# EAGLE design HIJACK_LQPF_B (EAGLE 5.09)
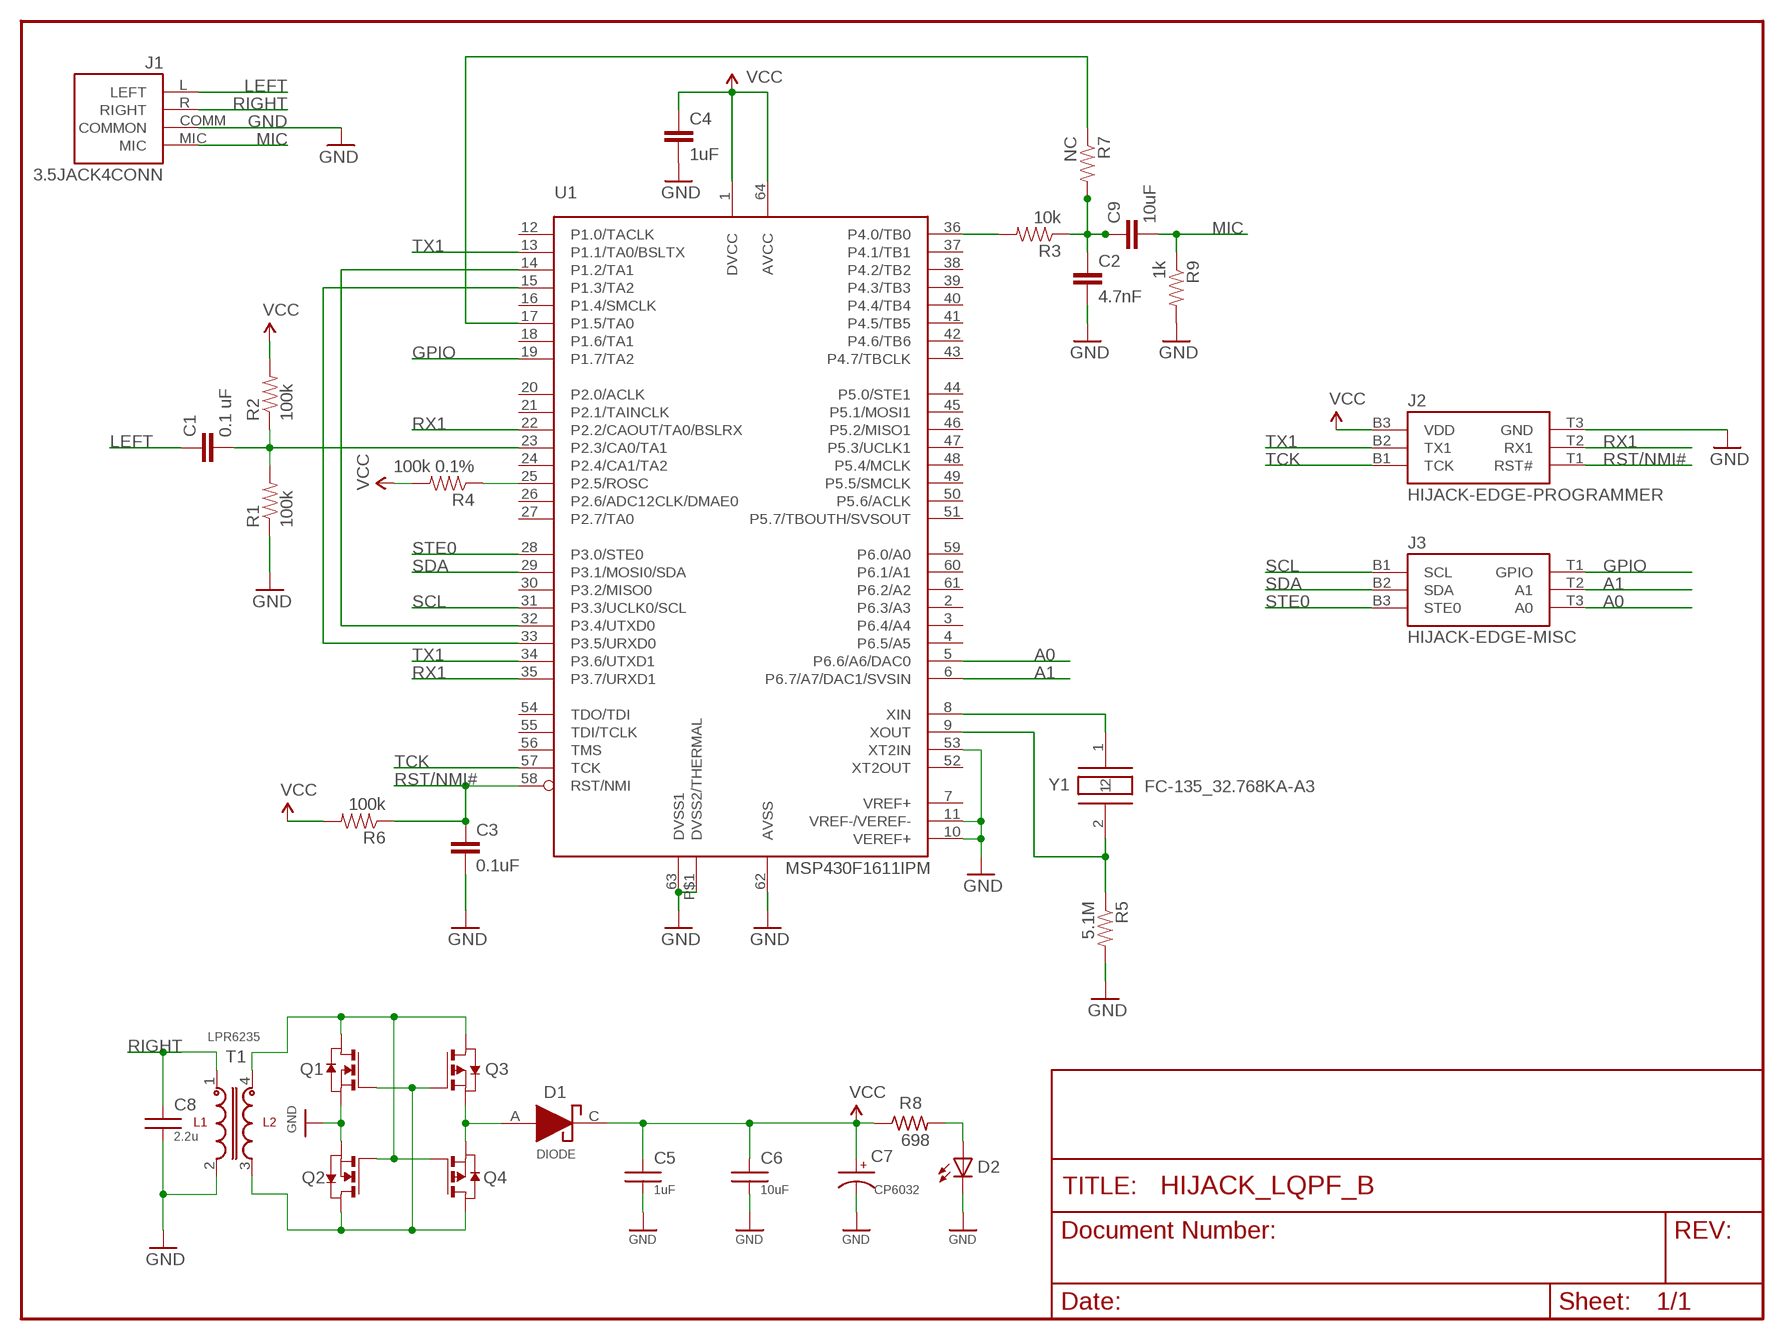
[diagram p0: schematic, sheet 1]

## Parts
C1  0.1 uF  CAP0603-CAP  [0603-CAP]
C2  4.7nF  CAP0603-CAP  [0603-CAP]
C3  0.1uF  CAP0603-CAP  [0603-CAP]
C4  1uF  CAP0603-CAP  [0603-CAP]
C5  1uF  C0603  [C0603]
C6  10uF  C0603  [C0603]
C7  CP6032  [CT6032]
C8  2.2u  C0603  [C0603]
C9  10uF  CAP0603-CAP  [0603-CAP]
D1  DIODE  [MINIMELF]
D2  LED0603  [LED-0603]
J1  3.5JACK4CONN  3.5JACK4CONNSUNSTONE_QUICKTURN  [PLUGBOARDCONNECTOR_SUNSTONE]
J2  HIJACK-EDGE-PROGRAMMER  [6-PIN-EDGE-CONNECTOR]
J3  HIJACK-EDGE-MISC  [6-PIN-EDGE-CONNECTOR]
Q1  NMOSSOT23  [SOT-23]
Q2  NMOSSOT23  [SOT-23]
Q3  PMOSSOT23  [SOT-23]
Q4  PMOSSOT23  [SOT-23]
R1  100k  RESISTOR0603-RES  [0603-RES]
R2  100k  RESISTOR0603-RES  [0603-RES]
R3  10k  RESISTOR0603-RES  [0603-RES]
R4  100k 0.1%  RESISTOR0603-RES  [0603-RES]
R5  5.1M  RESISTOR0603-RES  [0603-RES]
R6  100k  RESISTOR0603-RES  [0603-RES]
R7  NC  RESISTOR0603-RES  [0603-RES]
R8  698  R-US_R0603  [R0603]
R9  1k  RESISTOR0603-RES  [0603-RES]
T1  LPR6235  [LPR6235]
U1  MSP430F1611IPM  [PM/PAG64]
Y1  FC-135_32.768KA-A3  [FC-135]

## Nets
A0: J3.T3(A0) U1.5(P6.6/A6/DAC0)
A1: J3.T2(A1) U1.6(P6.7/A7/DAC1/SVSIN)
GND: C2.2 C3.2 C4.2 C5.2 C6.2 C7.- C8.2 D2.C J1.COMM(COMMON) J2.T3(GND) Q1.2(S) Q2.2(S) R1.1 R5.2 R9.2 T1.2 U1.10(VEREF+) U1.11(VREF-/VEREF-) U1.53(XT2IN) U1.62(AVSS) U1.63(DVSS1) U1.P$1(DVSS2/THERMAL)
GPIO: J3.T1(GPIO) U1.19(P1.7/TA2)
LEFT: C1.1 J1.L(LEFT)
MIC: C9.2 J1.MIC R9.1
N$1: C1.2 R1.2 R2.1 U1.23(P2.3/CA0/TA1)
N$2: U1.14(P1.2/TA1) U1.32(P3.4/UTXD0)
N$3: U1.15(P1.3/TA2) U1.33(P3.5/URXD0)
N$4: R4.1 U1.25(P2.5/ROSC)
N$5: U1.8(XIN) Y1.1
N$6: R7.1 U1.17(P1.5/TA0)
N$7: R3.2 U1.36(P4.0/TB0)
N$8: Q1.1(D) Q2.3(G) Q3.1(D) Q4.3(G) T1.4
N$9: Q1.3(G) Q2.1(D) Q3.3(G) Q4.1(D) T1.3
N$10: R5.1 U1.9(XOUT) Y1.2
N$11: D2.A R8.2
N$12: C2.1 C9.1 R3.1 R7.2
N$17: D1.A Q3.2(S) Q4.2(S)
RIGHT: C8.1 J1.R(RIGHT) T1.1
RST/NMI#: C3.1 J2.T1(RST#) R6.1 U1.58(RST/NMI)
RX1: J2.T2(RX1) U1.22(P2.2/CAOUT/TA0/BSLRX) U1.35(P3.7/URXD1)
SCL: J3.B1(SCL) U1.31(P3.3/UCLK0/SCL)
SDA: J3.B2(SDA) U1.29(P3.1/MOSI0/SDA)
STE0: J3.B3(STE0) U1.28(P3.0/STE0)
TCK: J2.B1(TCK) U1.57(TCK)
TX1: J2.B2(TX1) U1.13(P1.1/TA0/BSLTX) U1.34(P3.6/UTXD1)
VCC: C4.1 C5.1 C6.1 C7.+ D1.C J2.B3(VDD) R2.2 R4.2 R6.2 R8.1 U1.1(DVCC) U1.64(AVCC)
Unconnected: U1.2(P6.3/A3) U1.3(P6.4/A4) U1.4(P6.5/A5) U1.7(VREF+) U1.12(P1.0/TACLK) U1.16(P1.4/SMCLK) U1.18(P1.6/TA1) U1.20(P2.0/ACLK) U1.21(P2.1/TAINCLK) U1.24(P2.4/CA1/TA2) U1.26(P2.6/ADC12CLK/DMAE0) U1.27(P2.7/TA0) U1.30(P3.2/MISO0) U1.37(P4.1/TB1) U1.38(P4.2/TB2) U1.39(P4.3/TB3) U1.40(P4.4/TB4) U1.41(P4.5/TB5) U1.42(P4.6/TB6) U1.43(P4.7/TBCLK) U1.44(P5.0/STE1) U1.45(P5.1/MOSI1) U1.46(P5.2/MISO1) U1.47(P5.3/UCLK1) U1.48(P5.4/MCLK) U1.49(P5.5/SMCLK) U1.50(P5.6/ACLK) U1.51(P5.7/TBOUTH/SVSOUT) U1.52(XT2OUT) U1.54(TDO/TDI) U1.55(TDI/TCLK) U1.56(TMS) U1.59(P6.0/A0) U1.60(P6.1/A1) U1.61(P6.2/A2)

## Library data of the parts
C1-C4 C9 = SparkFun:CAP: Capacitor Standard 0603 ceramic capacitor, and 0.1" leaded capacitor.
C5 C6 C8 = umich:C
C7 = umich:CP
D1 = umich:DIODE
D2 = umich:LED: LEDs Standard schematic elements and footprints for 5mm, 3mm, 1206, and 0603 sized LEDs. 5mm - Spark Fun Electronics SKU : COM-00529 (and others)
J1 = Thomas:3.5JACK4CONN
J2 = Thomas:HIJACK-EDGE-PROGRAMMER
J3 = Thomas:HIJACK-EDGE-MISC
Q1 Q2 = zetex:NMOSSOT23: MOS FET
Q3 Q4 = zetex:PMOSSOT23: MOS FET
R1-R7 R9 = SparkFun:RESISTOR: Resistor Basic schematic elements and footprints for 0603, 1206, and PTH 1/10th watt (small) resistors.
R8 = rcl:R-US_: RESISTOR, American symbol
T1 = umich:LPR6235
U1 = Thomas:MSP430F1611
Y1 = berkeley-epic:FC-135_32.768KA-A3

## Board
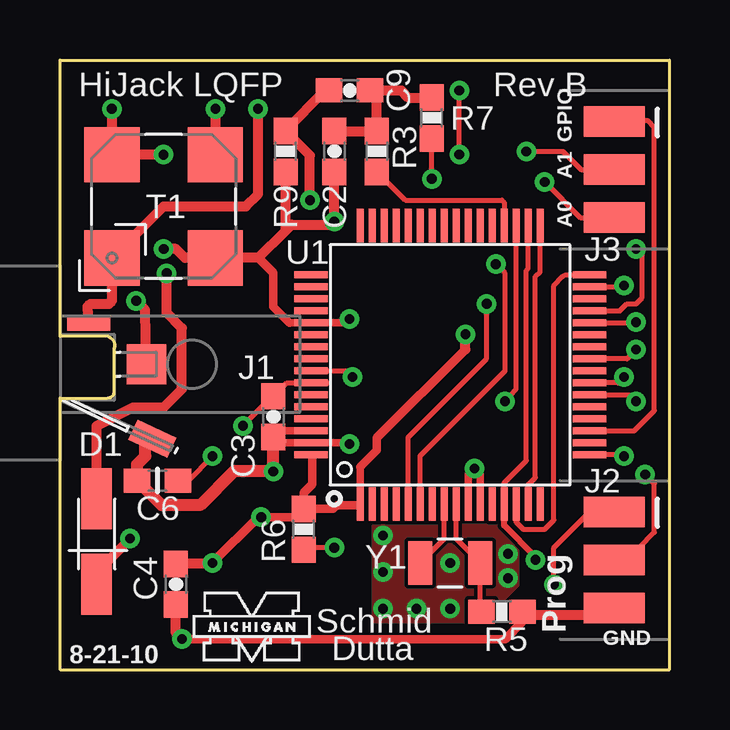
[diagram p1: board, top side]
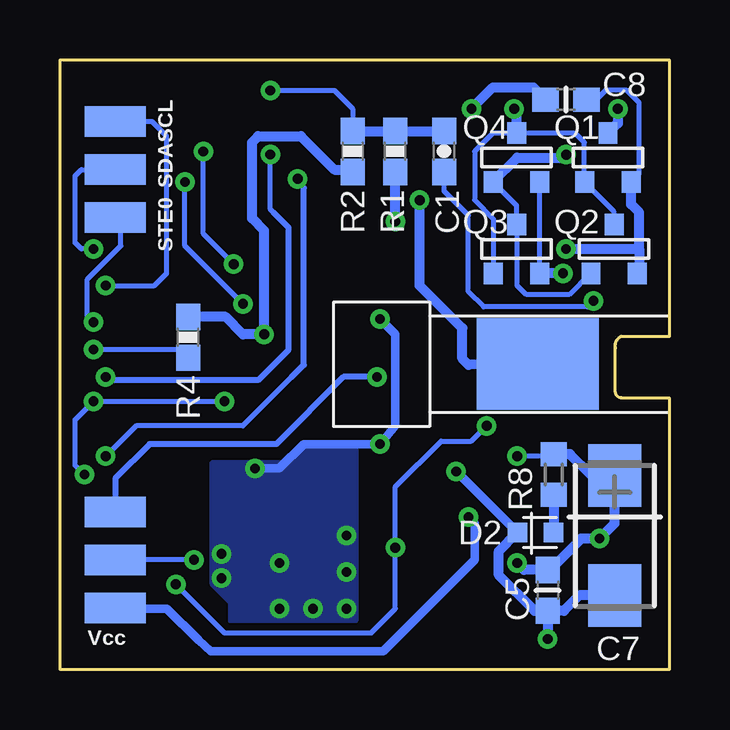
[diagram p2: board, bottom side, seen from below]

Size 25.4 x 25.4 mm. Coordinates in mm from the lower left corner, seen from the top.
Outline: 0,10.74 0,0 25.4,0 25.4,25.4 0,25.4 0,14.73
Copper layers (1*16): Top 0.0178mm / dielectric 1.4986mm / Bottom 0.0178mm
Design rules "SSC-EAGLE-2Lyr_v1.0.0.3 *": minimum track width 6mil, minimum drill 14mil, track to track 6mil, track to pad 6mil, pad to pad 6mil, via to via 6mil, smd to smd 6mil, copper to edge 20mil, drill to drill 16mil, minimum pad ring 8mil, minimum via ring 8mil, stop-mask expansion 3mil, vias tented up to drill 16mil, thermal gap 10mil

### Footprints (pad centres in the part's own frame; a part is rotated, then mirrored left to right if it is on the bottom)
0603-CAP = smd 1.1 x 1: 1 -0.85,0; 2 0.85,0
C0603 = smd 1.1 x 1: 1 -0.85,0; 2 0.85,0
CT6032 = smd 2.6 x 2.2: + -2.5,0; - 2.5,0
MINIMELF = smd 2.54 x 1.27: A -1.778,0; C 1.778,0
LED-0603 = smd 0.8 x 0.8: A 0,-0.75; C 0,0.75
PLUGBOARDCONNECTOR_SUNSTONE = smd 1.778 x 0.914 rotated 155: COMM 3.799,-3.103 | smd 1.651 x 1.651: L 3.55,0 | smd 5.08 x 3.81 bottom: MIC 5.45,0 | smd 1.778 x 0.635: R 1.15,1.706
6-PIN-EDGE-CONNECTOR = smd 2.54 x 1.27 bottom: B1 1.5,2; B2 1.5,0; B3 1.5,-2 | smd 2.54 x 1.27: T1 1.5,2; T2 1.5,0; T3 1.5,-2
SOT-23 = smd 0.787 x 0.889: 1 0.025,-1.016; 2 -0.94,1.016; 3 0.991,1.016
0603-RES = smd 1.1 x 1: 1 -0.85,0; 2 0.85,0
R0603 = smd 1 x 1.1: 1 -0.85,0; 2 0.85,0
LPR6235 = smd 2.3 x 2.3: 1 -2.15,2.15; 2 -2.15,-2.15; 3 2.15,-2.15; 4 2.15,2.15
PM/PAG64 = smd 1.4 x 0.3: 1 -5.8,3.75; 2 -5.8,3.25; 3 -5.8,2.75; 4 -5.8,2.25; 5 -5.8,1.75; 6 -5.8,1.25; 7 -5.8,0.75; 8 -5.8,0.25; 9 -5.8,-0.25; 10 -5.8,-0.75; 11 -5.8,-1.25; 12 -5.8,-1.75; 13 -5.8,-2.25; 14 -5.8,-2.75; 15 -5.8,-3.25; 16 -5.8,-3.75; 33 5.8,-3.75; 34 5.8,-3.25; 35 5.8,-2.75; 36 5.8,-2.25; 37 5.8,-1.75; 38 5.8,-1.25; 39 5.8,-0.75; 40 5.8,-0.25; 41 5.8,0.25; 42 5.8,0.75; 43 5.8,1.25; 44 5.8,1.75; 45 5.8,2.25; 46 5.8,2.75; 47 5.8,3.25; 48 5.8,3.75 | smd 0.3 x 1.4: 17 -3.75,-5.8; 18 -3.25,-5.8; 19 -2.75,-5.8; 20 -2.25,-5.8; 21 -1.75,-5.8; 22 -1.25,-5.8; 23 -0.75,-5.8; 24 -0.25,-5.8; 25 0.25,-5.8; 26 0.75,-5.8; 27 1.25,-5.8; 28 1.75,-5.8; 29 2.25,-5.8; 30 2.75,-5.8; 31 3.25,-5.8; 32 3.75,-5.8; 49 3.75,5.8; 50 3.25,5.8; 51 2.75,5.8; 52 2.25,5.8; 53 1.75,5.8; 54 1.25,5.8; 55 0.75,5.8; 56 0.25,5.8; 57 -0.25,5.8; 58 -0.75,5.8; 59 -1.25,5.8; 60 -1.75,5.8; 61 -2.25,5.8; 62 -2.75,5.8; 63 -3.25,5.8; 64 -3.75,5.8 | smd 0.152 x 0.305: P$1 -3.175,6.985
FC-135 = smd 1 x 1.8: 1 -1.25,0; 2 1.25,0

### Placement (x,y rotation side)
C1  9.4,21.59 90 bottom
C2  11.43,21.59 270 top
C3  8.89,10.54 270 top
C4  4.83,3.56 270 top
C5  5.08,3.3 270 bottom
C6  4.06,7.87 180 top
C7  2.29,5.59 270 bottom
C8  4.32,23.75 0 bottom
C9  12.06,24.13 180 top
D1  1.52,5.33 270 top
D2  5.59,5.71 90 bottom
J1  0.05,12.73 0 top
J2  21.59,4.57 0 top
J3  21.59,20.83 0 top
Q1  2.54,21.34 180 bottom
Q2  2.29,17.53 180 bottom
Q3  6.35,17.53 180 bottom
Q4  6.35,21.34 180 bottom
R1  11.43,21.59 90 bottom
R2  13.21,21.59 270 bottom
R3  13.21,21.59 270 top
R4  20.07,13.84 90 bottom
R5  18.41,2.41 0 top
R6  10.16,5.84 90 top
R7  15.49,22.99 90 top
R8  4.83,8.13 270 bottom
R9  9.4,21.59 270 top
T1  4.32,19.3 90 top
U1  16.26,12.7 90 top
U$2  [UMICH]  5.46,0.13 0 top
Y1  16.26,4.45 0 top

### Tracks (layer width: path | path; a pad name or v marks a point on that pad's centre or on a via)
A0  (via drill 0.41)
  Top 0.203: v20.19,20.32 21.68,18.83 J3.T3 | v17.78,15.24 17.78,12.95 14.51,9.68 U1.5
  Bottom 0.203: v17.78,15.24 20.19,17.65 v20.19,20.32
A1  (via drill 0.41)
  Top 0.203: v19.43,21.59 20.95,21.59 21.72,20.83 J3.T2 | v18.16,16.89 18.54,16.51 18.54,12.45 15.01,8.91 U1.6
  Bottom 0.203: v18.16,16.89 19.43,18.16 v19.43,21.59
GND  (via drill 0.41)
  Top 0.203: C3.2 9.15,9.95 | v12.06,14.61 11.81,14.45 | U1.11 17.53,6.9
  Top 0.254: 22.93,2.41 J2.T3
  Top 0.305: 9.15,9.95 U1.62 | 9.55,14.45 U1.53 11.81,14.45 | v12.06,9.4 12.01,9.45 U1.63 9.27,9.45 U1.P$1 9.06,9.53 C3.2 | U1.10 17.01,8.12 v17.27,8.38 17.51,8.15 U1.11
  Top 0.33: 9.55,14.45 8.89,15.11
  Top 0.356: 8.89,15.11 8.89,16.53 8.26,17.15 | v5.08,1.27 18.54,1.27 19.27,1.99 R5.2
  Top 0.406: v4.32,17.53 4.83,17.53 5.2,17.15 T1.2 8.26,17.15 9.4,18.29 | 3.56,9.35 J1.COMM | 4.87,2.67 C4.2 4.83,1.52 v5.08,1.27 | 22.93,2.41 22.93,2.36 22.86,2.29 19.39,2.29 R5.2 | 9.4,18.29 R9.2 | R1.1 v11.43,18.67 11.3,18.54 9.65,18.54 9.4,18.29
  Top 0.508: 3.56,9.35 3.56,8.89 3.21,8.55 C6.2 4.23,6.86 5.84,6.86 7.24,8.26 v8.89,8.26 C3.2
  Bottom 0.203: 1.27,16.51 Q2.2 | D2.C 6.35,5.84 6.34,5.83 D2.C | C5.2 5.63,2.45 | Q1.2 1.27,20.65 1.27,23.62 1.78,24.13 2.67,24.13 3.05,23.75 C8.2
  Bottom 0.356: D2.C v8.89,8.26 | v12.06,14.61 11.43,13.97 11.43,10.16 v12.06,9.4 15.24,9.4 16.26,8.38 v17.27,8.38
  Bottom 0.406: Q1.2 1.6,19.38 1.27,19.05 1.27,17.53 | 1.27,17.53 1.27,16.51 | C7.- 3.77,3.09 4.41,2.45 C5.2 v5.08,1.27 | Q2.2 1.35,16.59 | v4.32,17.53 1.27,17.53 | D2.C 7.11,4.94 7.11,3.94 5.63,2.45 | v11.43,18.67 R1.1
  other vias: 13.46,5.59 13.46,4.06 13.46,2.54 14.86,2.54 16.26,2.54 16.26,4.45 18.67,3.81 18.67,4.83
  pour Bottom: 13.08,9.4 13.08,2.03 18.29,2.03 18.29,2.79 19.05,3.56 19.05,8.64 16,8.64 15.24,9.4
  pour Top (no thermals): 19.05,5.97 13.08,5.97 13.08,2.03 17.53,2.03 19.05,3.56
GPIO
  Top 0.203: J3.T1 23.11,22.86 24.51,22.86 24.77,22.61 24.77,10.79 23.92,9.95 U1.19
LEFT  (via drill 0.41)
  Top 0.406: J1.L 3.55,14.99 v3.17,15.37
  Bottom 0.203: v3.17,15.37 3.43,15.11 7.75,15.11 8.38,15.75 8.38,18.92 9.4,19.94 C1.1
MIC  (via drill 0.41)
  Top 0.305: R9.1 9.4,22.48 | 11.05,24.13 C9.2
  Top 0.406: v10.41,19.56 10.41,21.42 R9.1 | C9.2 11.18,24.13 | 9.4,22.48 11.05,24.13
  Bottom 0.406: J1.MIC 8.38,12.7 8.64,12.95 8.64,14.22 10.41,16 v10.41,19.56
N$1  (via drill 0.41)
  Top 0.203: 22.09,11.95 U1.23 23.25,11.95 v23.5,12.19 | v16.64,21.46 v16.64,24.13
  Bottom 0.203: 23.37,12.06 v23.5,12.19 | v16.64,21.46 16.64,19.18 16.51,19.05 | v16.64,24.13 13.97,24.13 13.21,23.37 R2.1
  Bottom 0.254: 23.37,12.06 17.78,12.06 17.14,12.06 15.88,13.34 15.88,18.41 16.51,19.05
  Bottom 0.406: C1.2 R1.2 R2.1
N$2
  Top 0.203: U1.32 21.08,16.45 20.95,16.38 20.57,16 20.57,6.22 20.19,5.84 19.3,5.84 19.01,6.14 U1.14
N$3
  Top 0.203: U1.33 20.01,16.58 19.81,16.38 19.81,8 19.51,7.7 U1.15
N$4  (via drill 0.41)
  Top 0.203: v24,13.34 23.63,12.95 U1.25
  Bottom 0.203: 20.36,12.7 R4.1 20.41,13.34 v24,13.34
N$5
  Top 0.203: U1.8 16.01,5.45 Y1.1
N$6  (via drill 0.41, 0.41 pad 0.79)
  Top 0.203: U1.17 23.5,8.95 v23.5,8.89 | v15.49,20.45 R7.1
  Bottom 0.203: v23.5,8.89 22.23,10.16 17.78,10.16 15.75,12.19
  Bottom 0.254: 15.75,12.19 15.24,12.7 15.24,20.07 v15.49,20.45
N$7
  Top 0.203: R3.2 14.39,19.56 18.41,19.56 18.51,19.47 U1.36
N$8  (via drill 0.41)
  Top 0.406: v2.16,23.37 2.17,23.23 T1.4 v4.31,21.45
  Bottom 0.203: Q4.3 7.37,20.32 6.38,19.33 Q3.1 6.35,18.54 6.35,16 5.97,15.62 4.19,15.62 3.3,16.51 Q2.3
  Bottom 0.406: v2.16,23.37 2.16,22.76 Q1.1 | Q4.3 7.34,20.34 6.35,21.34 4.45,21.34 v4.31,21.45
N$9  (via drill 0.41)
  Top 0.406: T1.3 6.47,23.23 v6.48,23.37
  Bottom 0.203: 3.56,20.32 Q1.3 | Q2.1 2.31,19.07 3.56,20.32 | Q3.3 7.34,18.77 8.13,19.56 8.13,21.59 7.37,22.35 Q4.1 3.94,22.35 3.56,21.97 3.56,20.32
  Bottom 0.406: Q4.1 6.38,23.14 v6.48,23.37
N$10
  Top 0.203: U1.9 16.51,5.45 Y1.2 17.51,2.47 R5.1
N$11
  Bottom 0.406: D2.A 4.84,5.83 4.83,6.35 R8.2
N$12
  Top 0.406: C2.1 R3.1 13.17,22.73 13.17,22.82 13.21,22.86 13.21,23.88 12.95,24.13 C9.1 13.34,24.09 13.21,24.13 14.22,24.13 14.52,23.84 R7.2
N$17  (via drill 0.41)
  Top 0.406: D1.A 1.52,10.16 3.05,10.92 4.32,10.92 5.08,11.68 5.08,14.22 4.45,14.86 v4.45,16.51
  Bottom 0.203: Q3.2 Q4.2 5.41,20.37 5.33,20.45
  Bottom 0.406: v4.45,16.51 Q3.2
RIGHT  (via drill 0.41)
  Top 0.406: J1.R 1.15,15.12 1.27,15.24 2.03,15.24 2.17,15.38 T1.1 4.32,19.3 7.75,19.3 8.26,19.81 v8.26,23.37
  Bottom 0.406: v8.26,23.37 7.37,24.26 5.68,24.26 C8.1
RST/NMI#  (via drill 0.41)
  Top 0.203: 11.19,11.95 U1.58 9.45,11.95 C3.1 8.85,11.39 v7.62,10.16 | v11.43,5.08 10.25,5.08 R6.1 | 23.06,6.6 J2.T1 22.07,6.57 20.57,5.08 v20.57,3.56
  Bottom 0.203: v7.62,10.16 8.26,9.53 9.53,9.53 11.43,7.62 v11.43,5.08 11.43,2.54 12.45,1.52 18.54,1.52 v20.57,3.56
RX1  (via drill 0.41, 0.41 pad 0.79)
  Top 0.203: U1.22 22.06,11.43 23.75,11.43 v24,11.18 | U1.35 19.01,11.68 v18.54,11.18 | v24.38,8.13 24.77,7.75 24.77,5.71 24.13,5.08 23.6,5.08 J2.T2
  Bottom 0.203: v18.54,11.18 v24,11.18 24.77,10.41 24.77,8.51 v24.38,8.13
SCL  (via drill 0.41)
  Top 0.203: v23.5,16 23.42,15.95 U1.31
  Bottom 0.203: J3.B1 21.56,22.83 20.95,22.23 20.95,16.51 21.46,16 v23.5,16
SDA  (via drill 0.41)
  Top 0.203: U1.29 23.33,14.95 23.62,15.24 24,15.24 24.26,15.49 24.26,17.27 v24,17.53
  Bottom 0.203: v24,17.53 24.51,17.53 24.77,17.78 24.77,20.57 24.51,20.83 J3.B2
STE0  (via drill 0.41)
  Top 0.203: v24,14.48 23.98,14.45 U1.28
  Bottom 0.203: J3.B3 22.86,18.6 22.86,17.65 24.26,16.26 24.26,14.73 v24,14.48
TCK  (via drill 0.41)
  Top 0.203: v12.19,12.19 11.93,12.45 U1.57
  Bottom 0.254: v12.19,12.19 13.59,12.19 16.38,9.4 21.66,9.4 23.09,7.97 J2.B1
TX1  (via drill 0.41 pad 0.79)
  Top 0.203: U1.34 19.51,16.71 19.43,16.64 19.43,8.71 18.51,7.78 U1.13
  Top 0.254: v19.81,4.57 19.81,4.7 18.51,6 U1.13
  Bottom 0.203: v19.81,4.57 J2.B2
VCC  (via drill 0.41)
  Top 0.203: C4.1 C5.1 | 10.52,8.89 U1.64 | v6.35,8.89 5.33,7.87 C6.1
  Top 0.305: 12.51,8.45 U1.1 12.46,6.86
  Top 0.33: 12.51,8.45 12.57,8.51 13.21,9.14
  Top 0.356: R6.2 10.16,6.35 v8.38,6.35 8.26,6.35 v6.35,4.45 | 13.21,9.14 13.21,9.65 16.89,13.34 | R6.2 10.16,7.37 10.52,7.72 10.52,8.89 | R6.2 11.39,6.69 11.56,6.86 12.46,6.86
  Top 0.406: C4.1 6.22,4.41 v6.35,4.45 | v2.92,5.46 1.52,4.06 D1.C | 16.89,13.34 v16.89,13.97
  Bottom 0.203: 13.04,20.83 R2.2 | R4.2 19.6,14.69 | R8.1 4.91,8.89 v6.35,8.89
  Bottom 0.254: 23.11,2.54 J2.B3
  Bottom 0.356: 23.11,2.54 20.95,2.54 19.63,1.21 19.12,0.76 11.94,0.76 8.13,4.57 8.13,6.1 v8.38,6.35
  Bottom 0.406: R8.1 4.15,8.98 3.26,8.09 C7.+ 2.29,6.1 v2.92,5.46 3.68,5.46 4.95,4.19 C5.1 6.06,4.15 v6.35,4.45 | 13.04,20.83 13.97,20.83 15.37,22.23 17.14,22.23 17.4,21.97 17.4,18.8 16.89,18.29 v16.89,13.97 17.78,13.97 18.5,14.69 R4.2

### Text on the board
tPlace: HiJack LQFP | Rev B | Schmid | Dutta
tNames: GPIO | A1 | A0 | Prog | GND | 8-21-10
bNames: SCL | SDA | STE0 | Vcc